# EAGLE design AetherMesh interface to TI SmartRF06EB MEZZ (EAGLE 8.3.1)
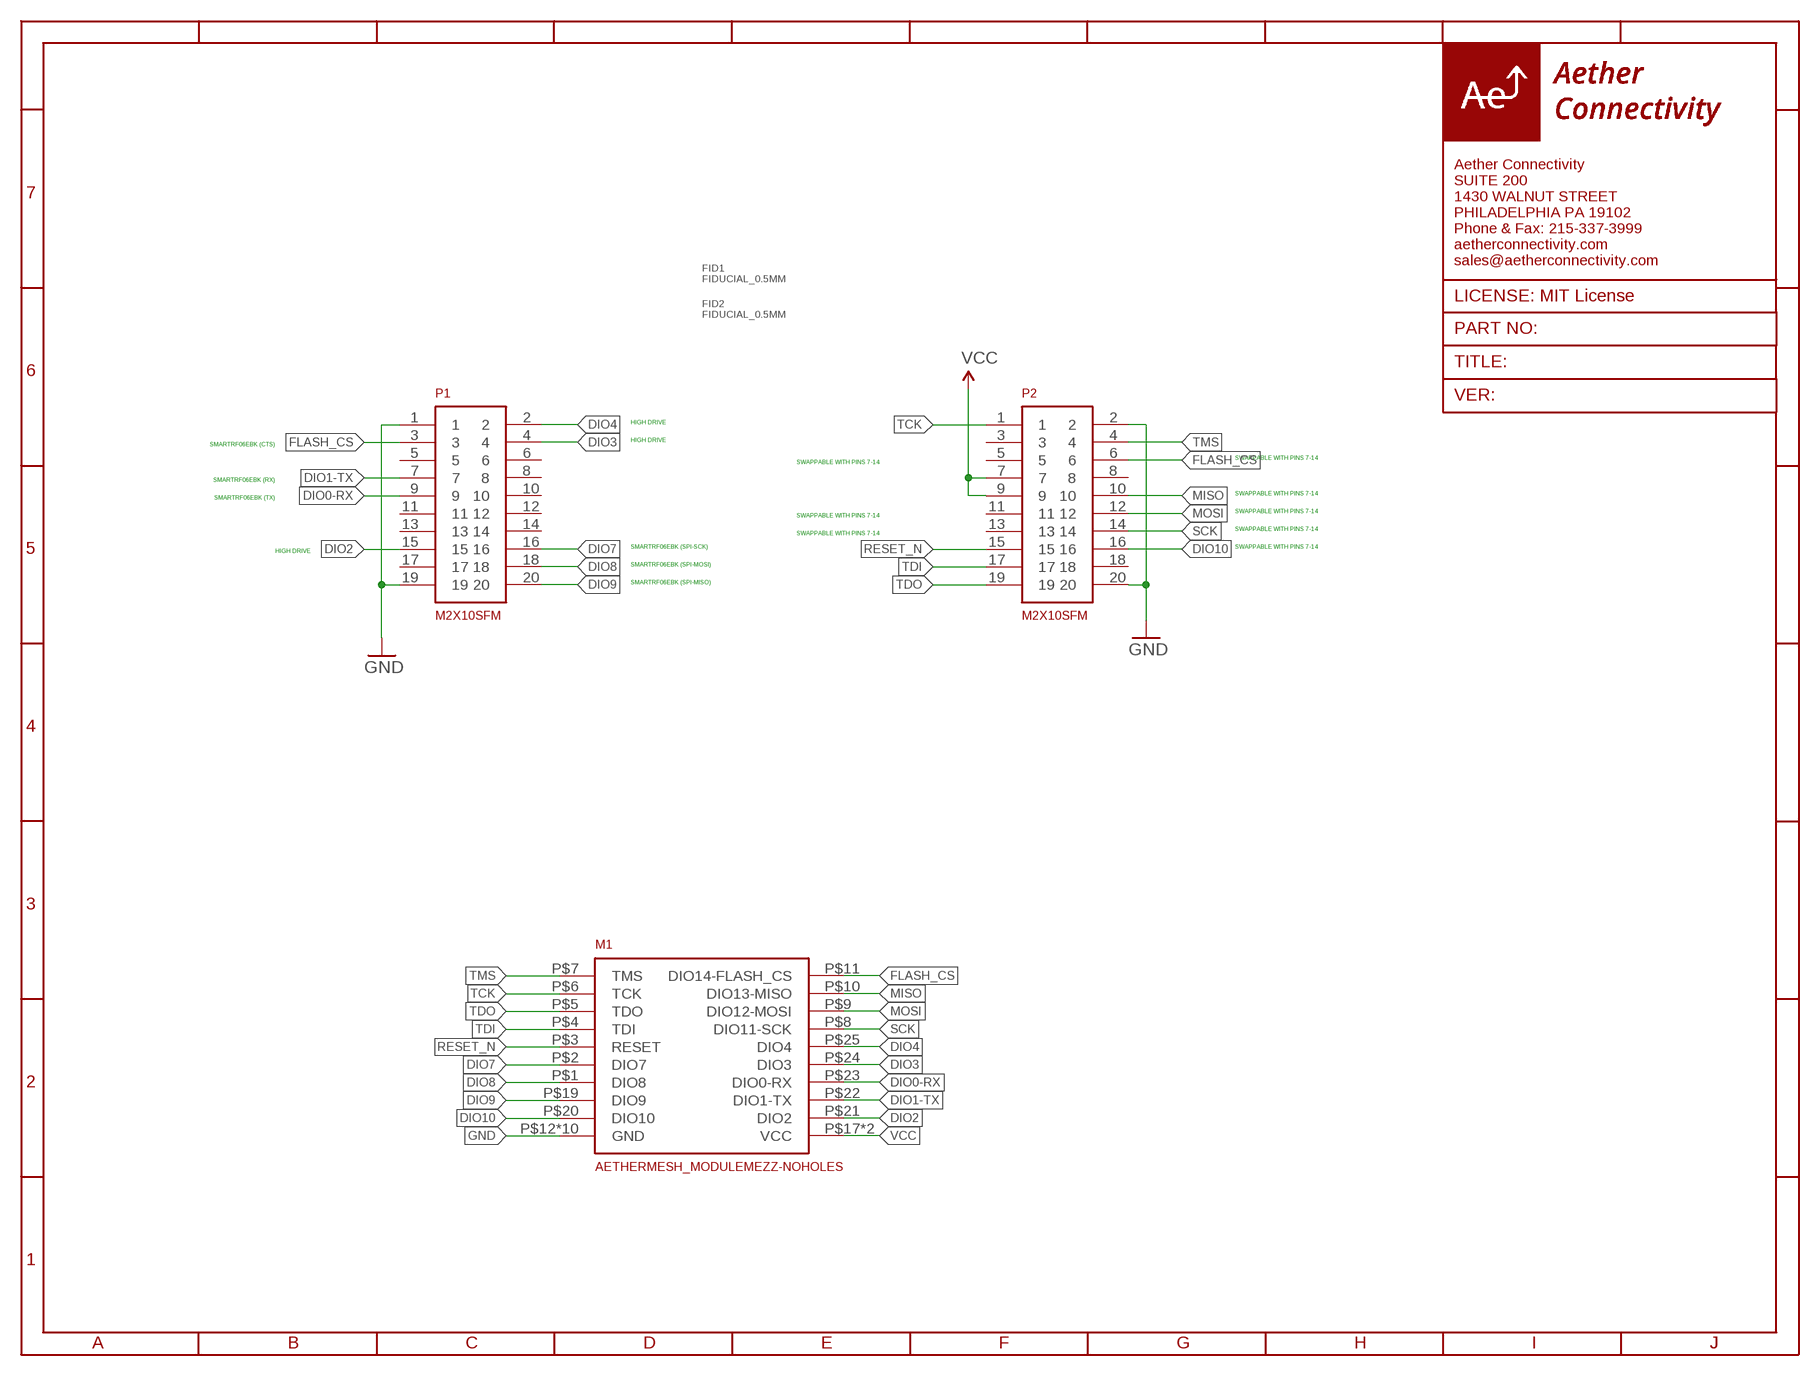
[diagram p0: schematic, sheet 1]

## Parts
FID1  FIDUCIAL_0.5MM  [FIDUCIAL_0.5MM]
FID2  FIDUCIAL_0.5MM  [FIDUCIAL_0.5MM]
M1  AETHERMESH_MODULEMEZZ-NOHOLES  [AETHERMESH_MEZZ_MOUNT_NOHOLES]
P1  M2X10SFM  [2X10_SFM-110-02-S-D-A-K-TR]
P2  M2X10SFM  [2X10_SFM-110-02-S-D-A-K-TR]

## Nets
DIO0-RX: M1.P$23(DIO0-RX) P1.9
DIO1-TX: M1.P$22(DIO1-TX) P1.7
DIO2: M1.P$21(DIO2) P1.15
DIO3: M1.P$24(DIO3) P1.4
DIO4: M1.P$25(DIO4) P1.2
DIO7: M1.P$2(DIO7) P1.16
DIO8: M1.P$1(DIO8) P1.18
DIO9: M1.P$19(DIO9) P1.20
DIO10: M1.P$20(DIO10) P2.16
FLASH_CS: M1.P$11(DIO14-FLASH_CS) P1.3 P2.6
GND: M1.P$12(GND) M1.P$13(GND) M1.P$14(GND) M1.P$15(GND) M1.P$16(GND) M1.P$26(GND) M1.P$27(GND) M1.P$28(GND) M1.P$29(GND) M1.P$30(GND) P1.1 P1.19 P2.2 P2.20
MISO: M1.P$10(DIO13-MISO) P2.10
MOSI: M1.P$9(DIO12-MOSI) P2.12
RESET_N: M1.P$3(RESET) P2.15
SCK: M1.P$8(DIO11-SCK) P2.14
TCK: M1.P$6(TCK) P2.1
TDI: M1.P$4(TDI) P2.17
TDO: M1.P$5(TDO) P2.19
TMS: M1.P$7(TMS) P2.4
VCC: M1.P$17(VCC) M1.P$18(VCC) P2.7 P2.9
Unconnected: P1.5 P1.6 P1.8 P1.10 P1.11 P1.12 P1.13 P1.14 P1.17 P2.3 P2.5 P2.8 P2.11 P2.13 P2.18

## Notes on the sheet
- HIGH DRIVE
- SMARTRF06EBK (CTS) | HIGH DRIVE
- SWAPPABLE WITH PINS 7-14 | SWAPPABLE WITH PINS 7-14
- SMARTRF06EBK (RX)
- SMARTRF06EBK (TX) | SWAPPABLE WITH PINS 7-14
- SWAPPABLE WITH PINS 7-14 | SWAPPABLE WITH PINS 7-14
- SWAPPABLE WITH PINS 7-14 | SWAPPABLE WITH PINS 7-14
- HIGH DRIVE | SMARTRF06EBK (SPI-SCK) | SWAPPABLE WITH PINS 7-14
- SMARTRF06EBK (SPI-MOSI)
- SMARTRF06EBK (SPI-MISO)

## Library data of the parts
FID1 FID2 = MF_Aesthetics:FIDUCIAL: Library: MF_Aesthetics Description: Fiducial marking for PCB alignment inside PNP and other machines.
M1 = AetherConnectivity:AETHERMESH_MODULE
P1 P2 = 3. growflux:M2X10

## Board
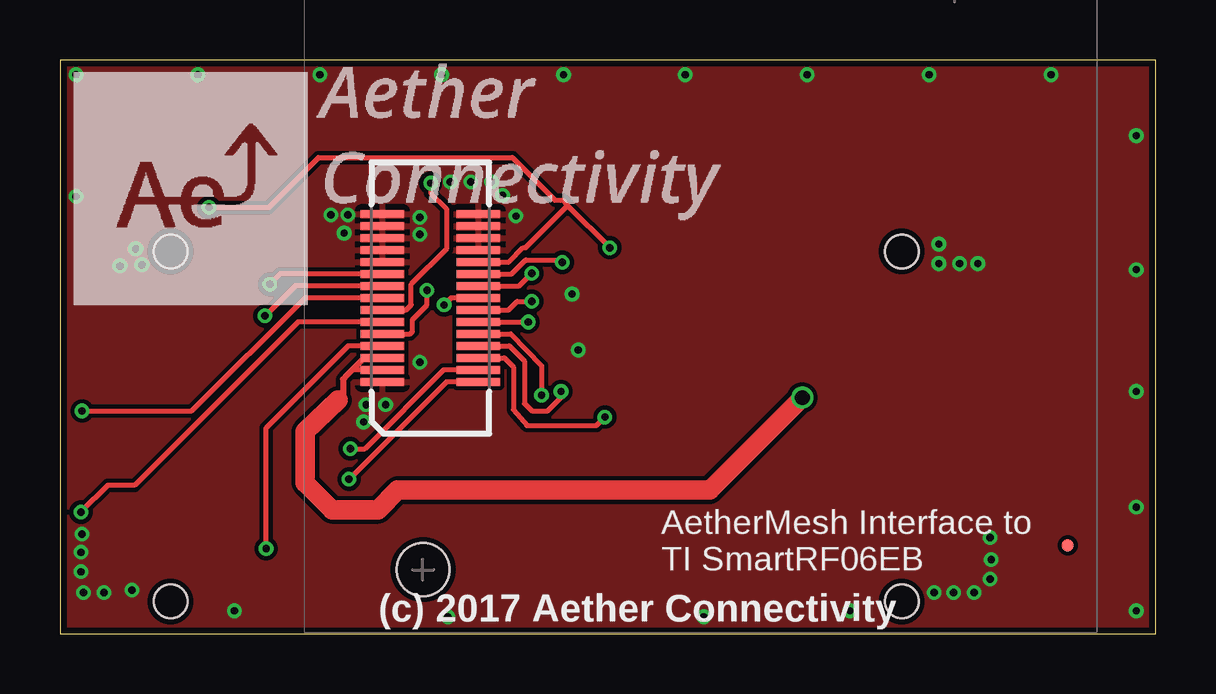
[diagram p1: board, top side]
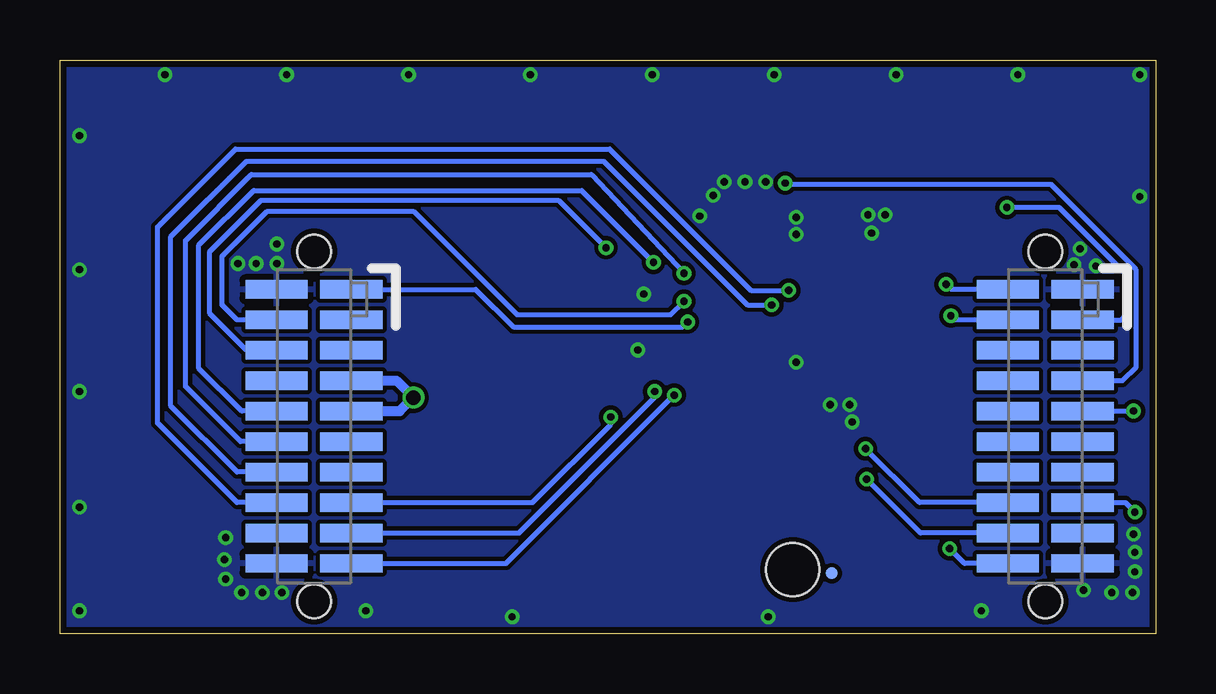
[diagram p2: board, bottom side, seen from below]

Size 45.68 x 23.93 mm. Coordinates in mm from the lower left corner, seen from the top.
Outline: 0,0 45.68,0 45.68,23.93 0,23.93 0,0
Copper layers (1*2*3*16): Top 0.035mm / dielectric 1.5mm / Route2 0.035mm / dielectric 0.15mm / Route3 0.035mm / dielectric 0.2mm / Bottom 0.035mm
Design rules "default *": minimum track width 6mil, minimum drill 10mil, track to track 6mil, track to pad 6mil, pad to pad 6mil, via to via 6mil, smd to smd 6mil, copper to edge 10mil, drill to drill 4mil, minimum pad ring 6mil, minimum via ring 6mil, stop-mask expansion 4mil, vias tented up to drill 20mil, thermal gap 10mil
Holes 2.2 mm at 15.13,2.68

### Footprints (pad centres in the part's own frame; a part is rotated, then mirrored left to right if it is on the bottom)
FIDUCIAL_0.5MM = smd 0.5 x 0.5: FID 0,0
AETHERMESH_MEZZ_MOUNT_NOHOLES = smd 1.8 x 0.32: P$1 2,-3.5; P$2 2,-3; P$3 2,-2.5; P$4 2,-2; P$5 2,-1.5; P$6 2,-1; P$7 2,-0.5; P$8 2,0; P$9 2,0.5; P$10 2,1; P$11 2,1.5; P$12 2,2; P$13 2,2.5; P$14 2,3; P$15 2,3.5; P$16 -2,-3.5; P$17 -2,-3; P$18 -2,-2.5; P$19 -2,-2; P$20 -2,-1.5; P$21 -2,-1; P$22 -2,-0.5; P$23 -2,0; P$24 -2,0.5; P$25 -2,1; P$26 -2,1.5; P$27 -2,2; P$28 -2,2.5; P$29 -2,3; P$30 -2,3.5
2X10_SFM-110-02-S-D-A-K-TR = smd 0.76 x 2.6: 1 -5.715,1.56; 2 -5.715,-1.56; 3 -4.445,1.56; 4 -4.445,-1.56; 5 -3.175,1.56; 6 -3.175,-1.56; 7 -1.905,1.56; 8 -1.905,-1.56; 9 -0.635,1.56; 10 -0.635,-1.56; 11 0.635,1.56; 12 0.635,-1.56; 13 1.905,1.56; 14 1.905,-1.56; 15 3.175,1.56; 16 3.175,-1.56; 17 4.445,1.56; 18 4.445,-1.56; 19 5.715,1.56; 20 5.715,-1.56 | hole 1.4: -7.3,0; 7.3,0

### Placement (x,y rotation side)
FID1  13.5,2.53 0 bottom
FID2  42.01,3.69 0 top
M1  15.44,14.01 0 top
P1  4.61,8.65 270 bottom
P2  35.09,8.65 270 bottom

### Tracks (layer width: path | path; a pad name or v marks a point on that pad's centre or on a via)
DIO0-RX  (via drill 0.3)
  Top 0.203: v0.92,9.3 5.49,9.3 10.21,14.01 M1.P$23
  Bottom 0.203: P1.9 0.93,9.29 v0.92,9.3
DIO1-TX  (via drill 0.3)
  Top 0.203: v15.45,18.8 15.45,18.39 16.11,17.73 16.11,16.05 14.64,14.58 14.64,13.72 14.43,13.51 M1.P$22
  Bottom 0.203: P1.7 1.39,10.56 0.82,11.12 0.82,15.19 4.38,18.75 15.4,18.75 v15.45,18.8
DIO2  (via drill 0.3)
  Top 0.203: v0.87,5.08 1.99,6.2 3.11,6.2 9.92,13.01 M1.P$21
  Bottom 0.203: P1.15 1.27,5.48 v0.87,5.08
DIO3  (via drill 0.3)
  Top 0.203: v8.54,13.26 9.79,14.51 9.8,14.51 M1.P$24
  Bottom 0.203: P1.4 8.38,13.1 v8.54,13.26
DIO4  (via drill 0.3)
  Top 0.203: v8.75,14.58 9.18,15.01 M1.P$25
  Bottom 0.203: P1.2 8.53,14.37 v8.75,14.58
DIO7  (via drill 0.3)
  Top 0.203: v12.1,7.72 12.71,7.72 16,11.01 M1.P$2
  Bottom 0.203: P1.16 9.85,5.48 v12.1,7.72
DIO8  (via drill 0.3)
  Top 0.203: v12.05,6.45 16.11,10.51 M1.P$1
  Bottom 0.203: P1.18 9.8,4.21 v12.05,6.45
DIO9  (via drill 0.3)
  Top 0.203: v8.59,3.56 8.59,8.59 12.02,12.01 M1.P$19
  Bottom 0.203: P1.20 7.98,2.94 v8.59,3.56
DIO10  (via drill 0.3)
  Top 0.203: v15.3,14.33 15.3,13.72 14.69,13.11 14.69,12.6 14.6,12.51 M1.P$20
  Bottom 0.203: P2.16 38.3,5.48 41.61,8.79 41.61,16.97 38.36,20.22 22.77,20.22 16.87,14.33 v15.3,14.33
FLASH_CS  (via drill 0.3)
  Top 0.203: 22.87,16.15 v22.92,16.1 21.17,17.86 | v6.21,17.78 8.7,17.78 10.78,19.86 18.86,19.86 20.63,18.09 20.94,18.09 21.17,17.86 | 21.17,17.86 19.41,16.1 19.31,16.1 18.72,15.51 M1.P$11
  Bottom 0.203: v22.92,16.1 24.9,18.09 37.3,18.09 39.43,15.95 39.43,13.36 37.9,11.83 P2.6 | P1.3 1.44,13.1 1.23,13.31 1.23,14.99 4.02,17.78 v6.21,17.78
GND  (via drill 0.3)
  Bottom 0.203: 36.69,14.33 P2.2
  other vias: 17.13,18.85 16.26,18.85 17.99,18.85 14.99,17.37 14.99,16.66 12,17.48 11.84,16.71 11.29,17.48 12.76,9.55 13.57,9.55 12.66,8.84 21.6,11.84 21.34,14.17 2.5,15.34 3.41,15.39 3.16,16.05 0.92,4.17 0.87,3.4 0.87,2.59 0.97,1.73 1.84,1.73 3.01,1.83 36.43,1.73 37.24,1.73 38.11,1.73 38.77,2.29 38.82,3.1 38.77,4.01 38.26,15.44 37.5,15.44 36.64,15.44 36.64,16.26 18.45,18.29 0.67,23.32 5.75,23.32 10.83,23.32 15.91,23.32 20.99,23.32 26.07,23.32 31.15,23.32 36.23,23.32 41.31,23.32 0.67,18.24 7.27,0.97 16.16,0.71 26.83,0.71 32.93,0.97 44.86,0.97 44.86,5.28 44.86,10.11 44.86,15.19 44.86,20.78 19.01,17.42 14.99,11.33
  pour Bottom (isolate 0.178, rank 2): 0.15,0.15 0.15,23.83 45.58,23.83 45.58,0.1
  pour Top (isolate 0.178, rank 2): 0.15,23.83 45.6,23.83 45.55,0.1 29.9,-0.03 0.15,0.13
MISO  (via drill 0.3)
  Top 0.203: v20.94,15.49 20.84,15.6 19.41,15.6 18.83,15.01 M1.P$10
  Bottom 0.203: P2.10 38.1,9.29 39.89,11.07 39.89,16.2 37.6,18.49 23.94,18.49 v20.94,15.49
MOSI  (via drill 0.3)
  Top 0.203: 19.64,15.01 v19.67,15.04 19.14,14.51 M1.P$9
  Bottom 0.203: P2.12 38.15,8.02 40.45,10.31 40.45,16.41 37.7,19.15 23.53,19.15 v19.67,15.04
RESET_N  (via drill 0.3)
  Top 0.203: v22.72,9.04 22.36,8.69 19.46,8.69 18.91,9.35 18.91,11.12 18.52,11.51 M1.P$3
  Bottom 0.203: P2.15 25.98,5.48 22.72,8.74 v22.72,9.04
SCK  (via drill 0.3)
  Top 0.203: v16.01,13.72 16.3,14.01 16.31,14.01 M1.P$8
  Bottom 0.203: P2.14 38.3,6.75 41.05,9.5 41.05,16.56 37.91,19.71 23.02,19.71 17.03,13.72 v16.01,13.72
TCK  (via drill 0.3)
  Top 0.203: v19.52,13.01 v19.51,13.01 M1.P$6
  Bottom 0.203: P2.1 28.35,14.37 26.78,12.8 19.72,12.8 v19.52,13.01
TDI  (via drill 0.3)
  Top 0.203: v20.89,10.11 20.89,9.86 20.33,9.3 19.67,9.3 19.36,9.6 19.36,11.38 18.73,12.01 M1.P$4
  Bottom 0.203: P2.17 26.54,4.21 20.89,9.86 v20.89,10.11
TDO  (via drill 0.3)
  Top 0.203: v20.07,9.96 20.07,11.18 18.79,12.51 M1.P$5
  Bottom 0.203: P2.19 27.09,2.94 v20.07,9.96
TMS  (via drill 0.3)
  Top 0.203: v19.67,13.87 19.06,13.87 18.7,13.51 M1.P$7
  Bottom 0.203: P2.4 38.3,13.1 38.92,13.72 38.92,15.75 37.04,17.63 30.95,17.63 26.63,13.31 20.23,13.31 v19.67,13.87
VCC  (via drill 0.61)
  Top 0.203: 12.69,11.51 M1.P$18 | M1.P$17 12.19,11.01
  Top 0.254: 11.59,9.75 11.79,9.96 11.79,10.62 11.95,10.77 12.19,11.01 12.69,11.51
  Top 0.813: 11.59,9.75 10.22,8.43 10.22,6.3 11.34,5.18 13.27,5.18 14.08,5.99 27.08,5.99 v30.95,9.86
  Bottom 0.406: P2.9 31.51,9.29 v30.95,9.86 31.65,10.56 P2.7

### Text on the board
tPlace: AetherMesh Interface to / TI SmartRF06EB | (c) 2017 Aether Connectivity